# EAGLE design BT-5 (EAGLE 9.6.2)
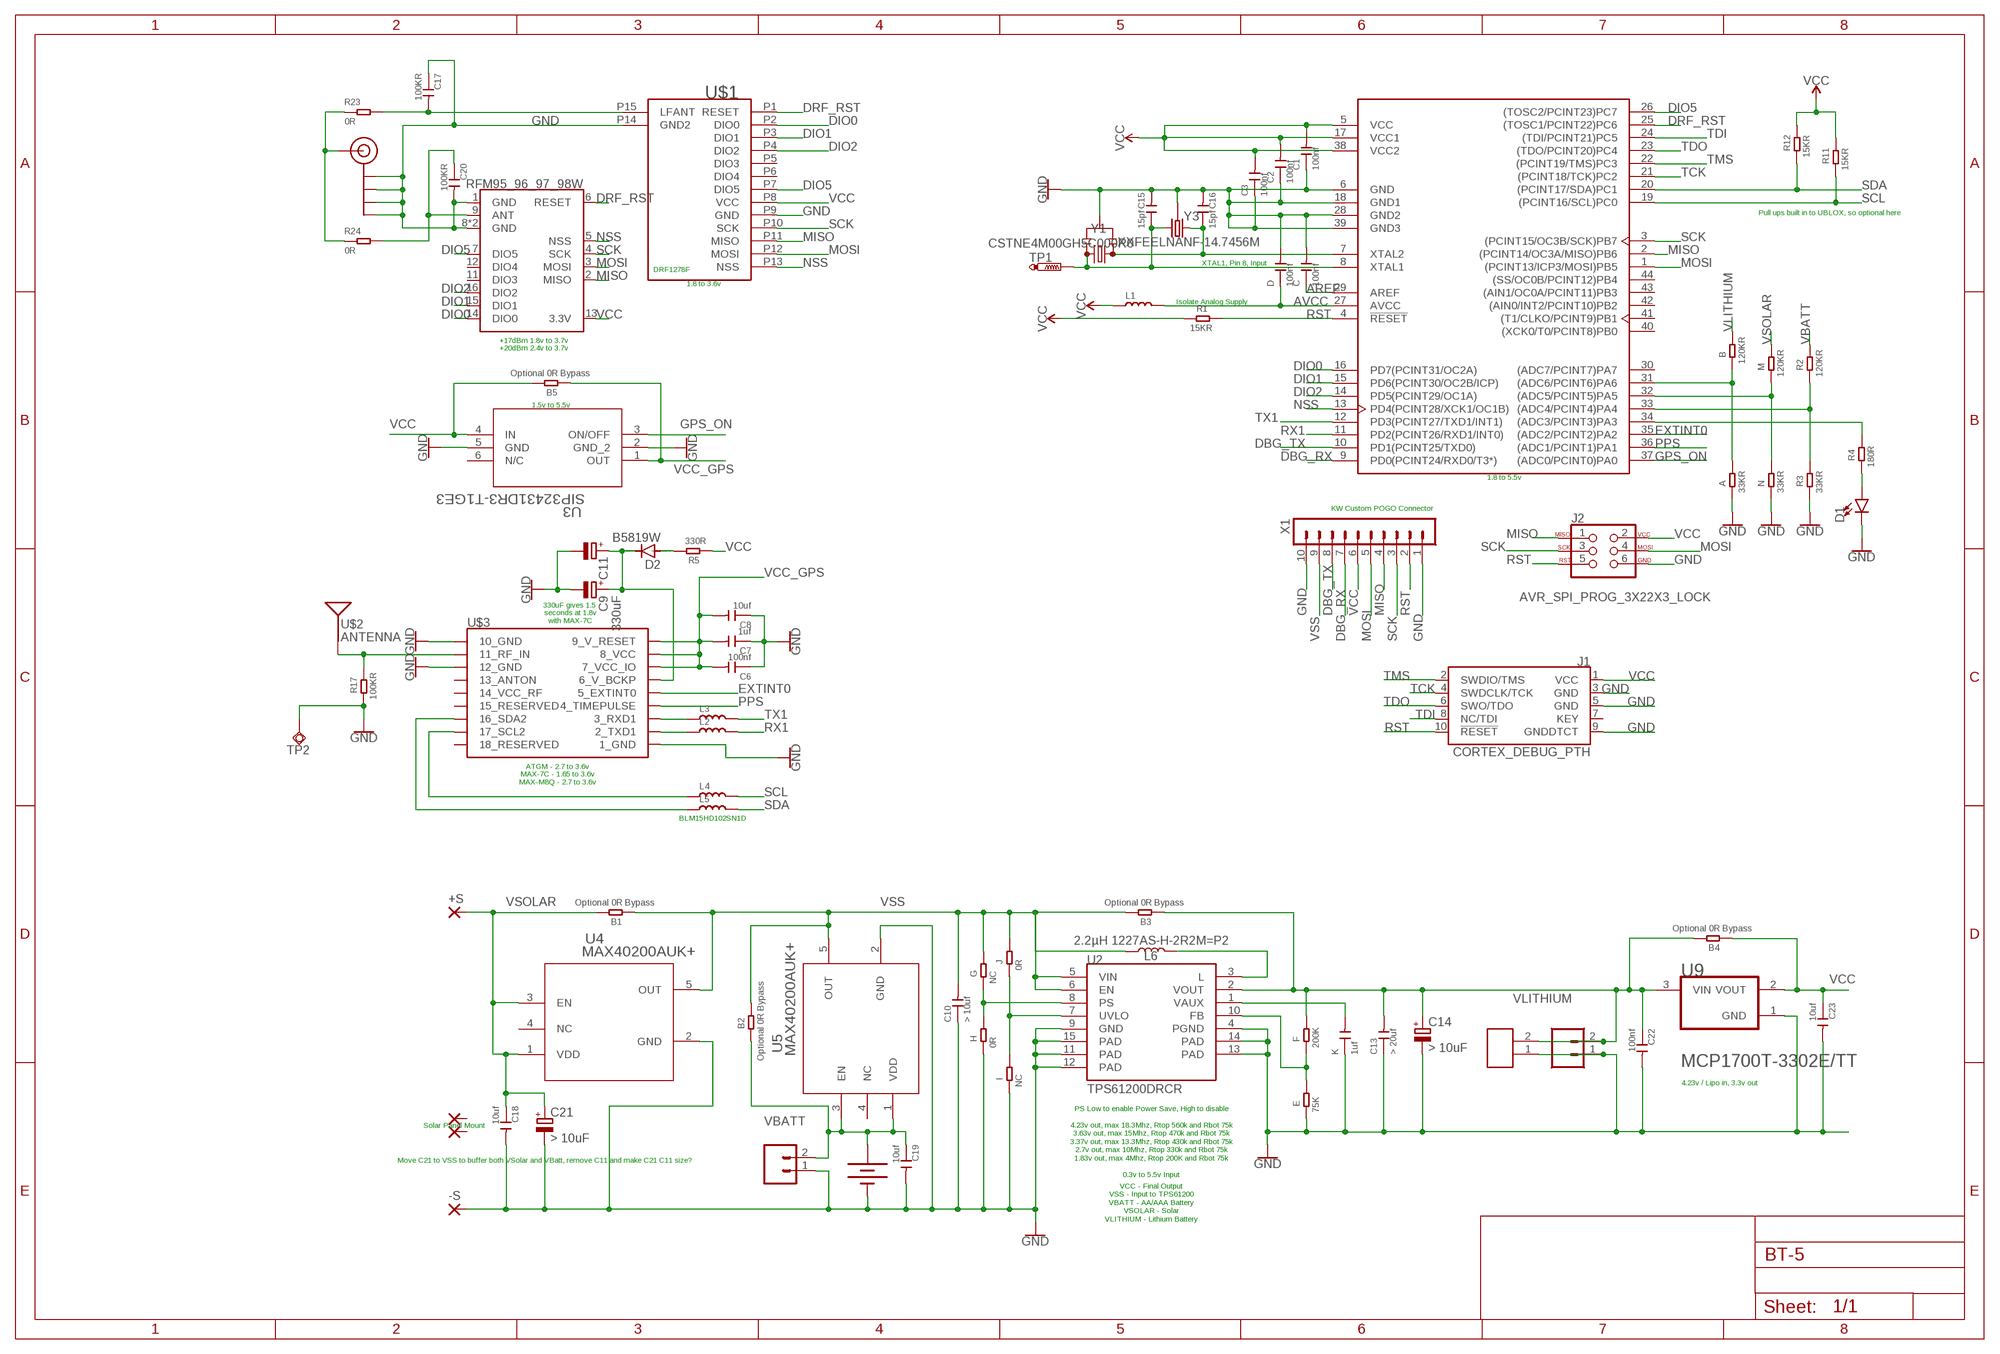
[diagram p0: schematic, sheet 1]

## Parts
+S  SMD2  [SMD1,27-2,54]
-S  SMD2  [SMD1,27-2,54]
A  33KR  SMD-RES-20K-5%-1/16W(0402)  [R0402]
B  120KR  SMD-RES-20K-5%-1/16W(0402)  [R0402]
B1  Optional 0R Bypass  SMD-RES-20K-5%-1/16W(0402)  [R0402]
B2  Optional 0R Bypass  SMD-RES-20K-5%-1/16W(0402)  [R0402]
B3  Optional 0R Bypass  SMD-RES-20K-5%-1/16W(0402)  [R0402]
B4  Optional 0R Bypass  SMD-RES-20K-5%-1/16W(0402)  [R0402]
B5  Optional 0R Bypass  SMD-RES-20K-5%-1/16W(0402)  [R0402]
BT1  BATTERY  [BATTERY-AA-AAA]
C  100nf  CERAMIC-100NF-25V-10%-X7R(0402)  [C0402]
C1  100nf  CERAMIC-100NF-25V-10%-X7R(0402)  [C0402]
C2  100nf  CERAMIC-100NF-25V-10%-X7R(0402)  [C0402]
C3  100nf  CERAMIC-100NF-25V-10%-X7R(0402)  [C0402]
C6  100nf  CERAMIC-100NF-25V-10%-X7R(0402)  [C0402]
C7  1uf  CERAMIC-1UF-10V-10%-X5R(0402)  [C0402]
C8  10uf  CERAMIC-10UF-6.3V-20%-X5R(0402)  [C0402]
C9  330uF  RCL_CPOL-EUSMCC  [RCL_SMC_C]
C10  > 10uf  CERAMIC-10UF-10V-10%-X5R(0603)  [C0603]
C11  C-POL_ECAP-10.5MM  [CAPAE1030X1050N]
C13  > 20uf  CERAMIC-10UF-10V-10%-X5R(0603)  [C0603]
C14  > 10uF  RCL_CPOL-EUSMCC  [RCL_SMC_C]
C15  15pf  CERAMIC-100NF-25V-10%-X7R(0402)  [C0402]
C16  15pf  CERAMIC-100NF-25V-10%-X7R(0402)  [C0402]
C17  100KR  CERAMIC-10UF-6.3V-20%-X5R(0402)  [C0402]
C18  10uf  CERAMIC-10UF-6.3V-20%-X5R(0402)  [C0402]
C19  10uf  CERAMIC-10UF-6.3V-20%-X5R(0402)  [C0402]
C20  100KR  CERAMIC-10UF-6.3V-20%-X5R(0402)  [C0402]
C21  > 10uF  RCL_CPOL-EUSMCC  [RCL_SMC_C]
C22  100nf  CERAMIC-100NF-25V-10%-X7R(0402)  [C0402]
C23  10uf  CERAMIC-10UF-6.3V-20%-X5R(0402)  [C0402]
D  100nf  CERAMIC-100NF-25V-10%-X7R(0402)  [C0402]
D1  LED0603  [LED-0603]
D2  B5819W  DIODE-SOD123  [SOD123]
E  75K  SMD-RES-20K-5%-1/16W(0402)  [R0402]
F  200K  SMD-RES-20K-5%-1/16W(0402)  [R0402]
G  NC  SMD-RES-20K-5%-1/16W(0402)  [R0402]
H  0R  SMD-RES-20K-5%-1/16W(0402)  [R0402]
I  NC  SMD-RES-20K-5%-1/16W(0402)  [R0402]
J  0R  SMD-RES-20K-5%-1/16W(0402)  [R0402]
J1  CORTEX_DEBUG_PTH  [2X5-PTH-1.27MM]
J2  AVR_SPI_PROG_3X22X3_LOCK  [2X3_LOCK]
J4  CONN_02JST-PTH-2-KIT  [JST-2-PTH-KIT]
J5  JST_ZH_2PIN  [JST_ZH_2PIN]
J6  CONN_02JST-PTH-2-KIT  [JST-2-PTH-KIT]
J$1  SMA_EDGE  [SMA-EDGE]
K  1uf  CERAMIC-1UF-10V-10%-X5R(0402)  [C0402]
L1  BLM15HD102SN1D  SMD-INDUCTOR-3.3NH-0.3NH-300MA(0402)  [L0402]
L2  BLM15HD102SN1D  SMD-INDUCTOR-3.3NH-0.3NH-300MA(0402)  [L0402]
L3  BLM15HD102SN1D  SMD-INDUCTOR-3.3NH-0.3NH-300MA(0402)  [L0402]
L4  BLM15HD102SN1D  SMD-INDUCTOR-3.3NH-0.3NH-300MA(0402)  [L0402]
L5  BLM15HD102SN1D  SMD-INDUCTOR-3.3NH-0.3NH-300MA(0402)  [L0402]
L6  2.2µH 1227AS-H-2R2M=P2  INDUCTOR-CDRH-4.7UH  [INDUCTOR_4.7UH]
M  120KR  SMD-RES-20K-5%-1/16W(0402)  [R0402]
N  33KR  SMD-RES-20K-5%-1/16W(0402)  [R0402]
NC1  SMD2  [SMD1,27-2,54]
NC2  SMD2  [SMD1,27-2,54]
R1  15KR  SMD-RES-20K-5%-1/16W(0402)  [R0402]
R2  120KR  SMD-RES-20K-5%-1/16W(0402)  [R0402]
R3  33KR  SMD-RES-20K-5%-1/16W(0402)  [R0402]
R4  180R  SMD-RES-20K-5%-1/16W(0402)  [R0402]
R5  330R  SMD-RES-20K-5%-1/16W(0402)  [R0402]
R11  15KR  SMD-RES-20K-5%-1/16W(0402)  [R0402]
R12  15KR  SMD-RES-20K-5%-1/16W(0402)  [R0402]
R17  100KR  SMD-RES-20K-5%-1/16W(0402)  [R0402]
R23  0R  SMD-RES-0R-1%-1/10W(0603)  [R0603]
R24  0R  SMD-RES-0R-1%-1/10W(0603)  [R0603]
TP1  TESTPAD_PTR1TP10R  [TESTPAD_TP10R]
TP2  TPSQTP08SQ  [TP08SQ]
U1  ATMEGA1284P-AU  [TQFP-44]
U2  TPS61200DRCR  TPS61200  [QFN-10_PAD]
U3  SIP32431DR3-T1GE3  [SC-70-6_VIS]
U4  MAX40200AUK+  RAJX_V4.5_REVA_MAX40200AUK+  [RAJX_V4.5_REVA_21-0057F_MXM]
U5  MAX40200AUK+  RAJX_V4.5_REVA_MAX40200AUK+  [RAJX_V4.5_REVA_21-0057F_MXM]
U6  RFM95_96_97_98W  RFM69HCW-433  [RFM69HCW-XXXS2]
U9  MICROCHIP_MCP1700T-3302E-TTMICROCHIP_MCP1700T-3302E-TT_0_0  [MICROCHIP_MCP1700T-3302E-TT_0]
U$1  DRF1278F  DRF1278F_2NO_PINS  [DRF1278F_2_NO_PINS]
U$2  ANTENNA  [ANT-GPS-3X10MM]
U$3  AVA_UBLOX_MAX-6  [AVA_UBLOX_MAX-6]
X1  KEW_HF_V13_M_1R10KW_50MIL-H  [KEW_HF_V13_M_1R09_50MIL-H]
Y1  CSTNE4M00GH5C000R0  SPARKFUN-CLOCKS-KW_RESONATOR-8MHZSMD_3.2X1.3  [SPARKFUN-CLOCKS-KW_RESONATOR-SMD-3.2X1.3]
Y3  XXFEELNANF-14.7456M  CRYSTAL-GROUNDEDSMD-3.2X2.5  [CRYSTAL-SMD-3.2X2.5MM]

## Nets
AREF: C.1 U1.29(AREF)
AVCC: D.1 L1.2 U1.27(AVCC)
DBG_RX: U1.9(PD0(PCINT24/RXD0/T3*)) X1.7
DBG_TX: U1.10(PD1(PCINT25/TXD0)) X1.8
DIO0: U1.16(PD7(PCINT31/OC2A)) U6.14(DIO0) U$1.P2(DIO0)
DIO1: U1.15(PD6(PCINT30/OC2B/ICP)) U6.15(DIO1) U$1.P3(DIO1)
DIO2: U1.14(PD5(PCINT29/OC1A)) U6.16(DIO2) U$1.P4(DIO2)
DIO5: U1.26((TOSC2/PCINT23)PC7) U6.7(DIO5) U$1.P7(DIO5)
DRF_RST: U1.25((TOSC1/PCINT22)PC6) U6.6(RESET) U$1.P1(RESET)
EXTINT0: U1.35((ADC2/PCINT2)PA2) U$3.5_EXTINT0
FB: E.2 F.1 U2.10(FB)
GND: -S.1(P) A.1 BT1.P$2(-) BT1.P$4(-) BT1.P$7(-) BT1.P$8(-) C1.1 C2.1 C3.1 C6.1 C7.1 C8.1 C9.- C10.1 C11.2(-) C13.1 C14.- C15.2 C16.2 C17.1 C18.2 C19.2 C20.2 C21.- C22.2 C23.2 C.2 D1.C D.2 E.1 H.1 I.1 J1.3(GND) J1.5(GND) J1.9(GNDDTCT) J2.6 J4.1 J5.1 J6.1 J$1.GND@0(GND) J$1.GND@1(GND) J$1.GND@2(GND) J$1.GND@3(GND) K.1 N.1 R3.1 R17.1 TP2.TP U1.6(GND) U1.18(GND1) U1.28(GND2) U1.39(GND3) U2.4(PGND) U2.9(GND) U2.11(PAD) U2.12(PAD) U2.13(PAD) U2.14(PAD) U2.15(PAD) U3.2(GND_2) U3.5(GND) U4.2(GND) U5.2(GND) U6.1(GND) U6.8(GND) U6.10(GND) U9.1(GND) U$1.P9(GND) U$1.P14(GND2) U$3.1_GND U$3.10_GND U$3.12_GND X1.1 X1.10 Y1.2 Y3.2 Y3.4
GPS_ON: U1.37((ADC0/PCINT0)PA0) U3.3(ON/OFF)
L: L6.P$2 U2.3(L)
MISO: J2.1 U1.2((PCINT14/OC3A/MISO)PB6) U6.2(MISO) U$1.P11(MISO) X1.4
MOSI: J2.4 U1.1((PCINT13/ICP3/MOSI)PB5) U6.3(MOSI) U$1.P12(MOSI) X1.5
N$1: C17.2 R23.2 U$1.P15(LFANT)
N$2: D1.A R4.1
N$3: C15.1 TP1.TP U1.8(XTAL1) Y1.3 Y3.3
N$4: C16.1 U1.7(XTAL2) Y1.1 Y3.1
N$5: R2.1 R3.2 U1.33((ADC4/PCINT4)PA4)
N$7: M.1 N.2 U1.32((ADC5/PCINT5)PA5)
N$8: R4.2 U1.34((ADC3/PCINT3)PA3)
N$10: R17.2 U$2.SIG(SIGNAL) U$3.11_RF_IN
N$11: C9.+ C11.1(+) D2.C U$3.6_V_BCKP
N$12: L3.1 U$3.3_RXD1
N$13: L2.1 U$3.2_TXD1
N$14: L4.1 U$3.17_SCL2
N$15: L5.1 U$3.16_SDA2
N$16: D2.A R5.2
N$20: A.2 B.1 U1.31((ADC6/PCINT6)PA6)
N$23: C20.1 R24.2 U6.9(ANT)
N$24: J$1.SIG(SIGNAL) R23.1 R24.1
NSS: U1.13(PD4(PCINT28/XCK1/OC1B)) U6.5(NSS) U$1.P13(NSS)
PPS: U1.36((ADC1/PCINT1)PA1) U$3.4_TIMEPULSE
PS: G.1 H.2 U2.8(PS)
RST: J1.10(!RESET) J2.5 R1.2 U1.4(!RESET) X1.2
RX1: L2.2 U1.11(PD2(PCINT26/RXD1/INT0))
SCK: J2.3 U1.3((PCINT15/OC3B/SCK)PB7) U6.4(SCK) U$1.P10(SCK) X1.3
SCL: L4.2 R11.1 U1.19((PCINT16/SCL)PC0)
SDA: L5.2 R12.1 U1.20((PCINT17/SDA)PC1)
TCK: J1.4(SWDCLK/TCK) U1.21((PCINT18/TCK)PC2)
TDI: J1.8(NC/TDI) U1.24((TDI/PCINT21)PC5)
TDO: J1.6(SWO/TDO) U1.23((TDO/PCINT20)PC4)
TMS: J1.2(SWDIO/TMS) U1.22((PCINT19/TMS)PC3)
TX1: L3.2 U1.12(PD3(PCINT27/TXD1/INT1))
UVLO: I.2 J.1 U2.7(UVLO)
VAUX: K.2 U2.1(VAUX)
VBATT: B2.1 BT1.P$1(+) BT1.P$3(+) BT1.P$5(+) BT1.P$6(+) C19.1 J4.2 R2.2 U5.1(VDD) U5.3(EN)
VCC: B4.1 B5.2 C1.2 C2.2 C3.2 C23.1 J1.1(VCC) J2.2 L1.1 R1.1 R5.1 R11.2 R12.2 U1.5(VCC) U1.17(VCC1) U1.38(VCC2) U3.4(IN) U6.13(3.3V) U9.2(VOUT) U$1.P8(VCC) X1.6
VCC_GPS: B5.1 C6.2 C7.2 C8.2 U3.1(OUT) U$3.7_VCC_IO U$3.8_VCC U$3.9_V_RESET
VLITHIUM: B3.1 B4.2 B.2 C13.2 C14.+ C22.1 F.2 J5.2 J6.2 U2.2(VOUT) U9.3(VIN)
VSOLAR: +S.1(P) B1.2 C18.1 C21.+ M.2 U4.1(VDD) U4.3(EN)
VSS: B1.1 B2.2 B3.2 C10.2 G.2 J.2 L6.P$1 U2.5(VIN) U2.6(EN) U4.5(OUT) U5.5(OUT) X1.9
Unconnected: J1.7(KEY) NC1.1(P) NC2.1(P) U1.30((ADC7/PCINT7)PA7) U1.40((XCK0/T0/PCINT8)PB0) U1.41((T1/CLKO/PCINT9)PB1) U1.42((AIN0/INT2/PCINT10)PB2) U1.43((AIN1/OC0A/PCINT11)PB3) U1.44((SS/OC0B/PCINT12)PB4) U3.6(N/C) U4.4(NC) U5.4(NC) U6.11(DIO3) U6.12(DIO4) U$1.P5(DIO3) U$1.P6(DIO4) U$3.13_ANTON U$3.14_VCC_RF U$3.15_RESERVED U$3.18_RESERVED

## Notes on the sheet
- Pull ups built in to UBLOX, so optional here
- XTAL1, Pin 8, Input
- DRF1278F
- 1.8 to 3.6v
- Isolate Analog Supply
- +17dBm 1.8v to 3.7v
  +20dBm 2.4v to 3.7v
- 1.5v to 5.5v
- 1.8 to 5.5v
- KW Custom POGO Connector
- 330uF gives 1.5 
  seconds at 1.8v
  with MAX-7C
- ATGM - 2.7 to 3.6v
  MAX-7C - 1.65 to 3.6v
  MAX-M8Q - 2.7 to 3.6v
- BLM15HD102SN1D
- 4.23v / Lipo in, 3.3v out
- PS Low to enable Power Save, High to disable
  
  4.23v out, max 18.3Mhz, Rtop 560k and Rbot 75k
  3.63v out, max 15Mhz, Rtop 470k and Rbot 75k
  3.37v out, max 13.3Mhz, Rtop 430k and Rbot 75k
  2.7v out, max 10Mhz, Rtop 330k and Rbot 75k
  1.83v out, max 4Mhz, Rtop 200K and Rbot 75k
  
  0.3v to 5.5v Input
- Solar Panel Mount
- Move C21 to VSS to buffer both VSolar and VBatt, remove C11 and make C21 C11 size?
- VCC - Final Output
  VSS - Input to TPS61200
  VBATT - AA/AAA Battery
  VSOLAR - Solar
  VLITHIUM - Lithium Battery

## Library data of the parts
+S -S NC1 NC2 = wirepad:SMD2: SMD PAD
A B B1-B5 E F G I M N R1-R5 R11 R12 R17 = OPL_Resistor:SMD-RES-20K-5%-1/16W(0402): 301012018; MPN: RC0402JR-070RL; VALUE: 0R
BT1 = Dual AA and AAA - RS Keystone 55 and 53 SMD:BATTERY: Battery - Single Cell A variety of battery chemistries, sizes, and footprints. Device List: 20MM_PTH - Coin Cell Battery Holder - 20mm (PTH) <https://www.sparkfun.com/products/783> 6.8MM_PTH - Coin Cell Battery Holder - 6.8MM(SMD) <https://www.digikey.com/product-detail/en/seiko-instruments/MS621FE-FL11E/728-1057-ND/1889208?WT.srch=1&gclid=CNOQ5a6LzdQCFZS2wAodXCkE0g> 12MM_SMD - Coin Cell Battery Holder - 12mm (SMD) <https://www.sparkfun.com/products/10592> 12MM_PTH - Coin Cell Battery Holder - 12mm (PTH) <https://www.sparkfun.com/products/7948> 20MM_SMD - 20mm Coin Cell Battery Holder (SMD) (2 legs) Used on the Big Time Watch Kit <https://www.sparkfun.com/products/11734> 20MM_SMD_4LEGS - Coin Cell Battery Holder - 20mm (SMD) <https://www.sparkfun.com/products/11892> 20MM_SMD_4LEGS_OVERPASTE - Coin Cell Battery Holder - 20mm (SMD) <https://www.sparkfun.com/products/11892> (Over-paste on the legs) 24.5MM_PTH - Coin Cell Battery Holder - 24.5mm (PTH) <https://www.sparkfun.com/products/8863> 9V - 9V Battery Holder - PC Mount Used on the SparkFun SparkPunk Sound Kit <https://www.sparkfun.com/products/11177> and SparkFun SparkPunk Sequencer Kit <https://www.sparkfun.com/products/12707> 18650 - Battery Holder - 18650 (PTH) <https://www.sparkfun.com/products/13113> AA - Battery Holder - 1xAA (PTH) <https://www.sparkfun.com/products/7949> AAA - Battery Holder - 1xAAA (PTH) <https://www.sparkfun.com/products/12718> AA_KIT - Battery Holder - 1xAA (PTH) <https://www.sparkfun.com/products/7949> Special kit package - pads only have exposed copper on one side of the board. AAA_KIT - Battery Holder - 1xAAA (PTH) <https://www.sparkfun.com/products/12718> Special kit package - pads only have exposed copper on one side of the board.
C C1-C3 C6 C22 D = OPL_Capacitor:CERAMIC-100NF-25V-10%-X7R(0402): 302010024; MPN: CC0402KRX7R8BB104
C7 K = OPL_Capacitor:CERAMIC-1UF-10V-10%-X5R(0402): 302010040; MPN: CC0402KRX5R6BB105
C8 C18 C19 C23 = OPL_Capacitor:CERAMIC-10UF-6.3V-20%-X5R(0402): 302010053; MPN: CC0402MRX5R5BB106
C9 C14 C21 = KEW_HF_V16:RCL_CPOL-EU: POLARIZED CAPACITOR, European symbol
C10 C13 = OPL_Capacitor:CERAMIC-10UF-10V-10%-X5R(0603): 302010103; MPN: CC0603KRX5R6BB106; VALUE: 10uf
C11 = Capacitor:C-POL: Capacitor Polarised - Generic; CATEGORY: Capacitor
C15 C16 = OPL_Capacitor:CERAMIC-100NF-25V-10%-X7R(0402): 302010024; MPN: CC0402KRX7R8BB104; VALUE: 100nf
C17 C20 = OPL_Capacitor:CERAMIC-10UF-6.3V-20%-X5R(0402): 302010053; MPN: CC0402MRX5R5BB106; VALUE: 10uf
D1 = SparkFun-LED:LED: LED (Generic) Standard schematic elements and footprints for 5mm, 3mm, 1206, and 0603 sized LEDs. Generic LEDs with no color specified.
D2 = diode:DIODE-: DIODE; LCSC_PART: C8598
H J = OPL_Resistor:SMD-RES-20K-5%-1/16W(0402): 301012018; MPN: RC0402JR-070RL
J1 = SparkFun-Connectors:CORTEX_DEBUG: Cortex Debug Connector - 10 pin Supports JTAG debug, Serial Wire debug, and Serial Wire Viewer. PTH and SMD connector options available. General Connector Information <http://infocenter.arm.com/help/topic/com.arm.doc.faqs/attached/13634/cortex_debug_connectors.pdf> Products: PTH Connector <http://www.digikey.com/product-detail/en/cnc-tech/3220-10-0100-00/1175-1627-ND/3883661> -via Digi-Key SparkFun PSoc <https://www.sparkfun.com/products/13229> SparkFun T <https://www.sparkfun.com/products/13810>
J2 = SparkFun-Connectors:AVR_SPI_PROG_3X2: AVR ISP 6 Pin This is the reduced ISP connector for AVR programming. Common on Arduino. This footprint will take up less PCB space and can be used with a 10-pin to 6-pin adapter such as SKU: BOB-08508 **Special note about "TEST_POINT" package. The stop mask is on the top side, so if you want your programming test points to be on the bottom of your board, make sure to place this package on the bottom side of the board. This also ensure that the orientation to program from the bottom side will be correct. SparkFun Products: SparkFun ISP Pogo Adapter <https://www.sparkfun.com/products/11591> - NS Tiny AVR Programmer <https://www.sparkfun.com/products/11801> -PTH
J4 J6 = ESP32-Cam-Pico-V4:CONN_02: Multi connection point. Often used as Generic Header-pin footprint for 0.1 inch spaced/style header connections On any of the 0.1 inch spaced packages, you can populate with these: Break Away Headers - Straight <https://www.sparkfun.com/products/116> (PRT-00116) Break Away Male Headers - Right Angle <https://www.sparkfun.com/products/553> (PRT-00553) Female Headers <https://www.sparkfun.com/products/115> (PRT-00115) Break Away Headers - Machine Pin <https://www.sparkfun.com/products/117> (PRT-00117) Break Away Female Headers - Swiss Machine Pin <https://www.sparkfun.com/products/743> (PRT-00743) For SCREWTERMINALS and SPRING TERMINALS visit here: Screw Terimnals on SparkFun.com <https://www.sparkfun.com/search/results?term=Screw+Terminals> (5mm/3.5mm/2.54mm spacing) This device is also useful as a general connection point to wire up your design to another part of your project. Our various solder wires solder well into these plated through hole pads. Hook-Up Wire - Assortment (Stranded, 22 AWG) <https://www.sparkfun.com/products/11375> (PRT-11375) Hook-Up Wire - Assortment (Solid Core, 22 AWG) <https://www.sparkfun.com/products/11367> (PRT-11367) View the entire wire category on our website here <https://www.sparkfun.com/categories/141> Special notes: Molex polarized connector foot print use with: PRT-08233 with associated crimp pins and housings. 2.54_SCREWTERM for use with PRT-10571. 3.5mm Screw Terminal footprints for PRT-08084 5mm Screw Terminal footprints for use with PRT-08432; PROD_ID: CONN-13512; SF_ID: PRT-09918; SF_SKU: PRT-08432; SKU: PRT-09914; STOREFRONT_SKU: PRT-15898
J5 = ESP32-Cam-Pico-V4:JST_ZH_2PIN: JST ZH connector, 2 pins ZH has 1.5mm spacing. Datasheet <http://www.jst-mfg.com/product/pdf/eng/eZH.pdf>
J$1 = ESP32-Cam-Pico-V4:SMA_EDGE: SMA Antenna Connector End launch SMA connector. The paste layer has been removed so that the connector can be hand soldered onto the board after reflow.
L1-L5 = OPL_Inductor:SMD-INDUCTOR-3.3NH-0.3NH-300MA(0402): 303010056; VALUE: 3.3NH- 300MA
L6 = SparkFun-Coils:INDUCTOR: Inductors Resist changes in electrical current. Basically a coil of wire. SparkFun Products: SparkFun Load Cell Amplifier - HX711 <https://www.sparkfun.com/products/13879> IOIO-OTG - V2.2 <https://www.sparkfun.com/products/13613>; LCSC_PART: C435389; PROD_ID: NDUC-10146; VALUE: 4.7µH/±30%/1.2A
R23 R24 = OPL_Resistor:SMD-RES-0R-1%-1/10W(0603): 301012029; MPN: RC0603FR-071K5L; VALUE: 1.5K
TP1 = KEW_HF_V16:TESTPAD_PTR1: TEST PIN
TP2 = testpad:TPSQ: Test pad
U1 = Microcontroller:ATMEGA1284P-AU: IC MCU 8BIT 128KB FLASH 44TQFP Manufacturer's datasheet <http://ww1.microchip.com/downloads/en/DeviceDoc/ATmega164A_PA-324A_PA-644A_PA-1284_P_Data-Sheet-40002070A.pdf>; CREATED_BY: PCBLayout.com; DIGIKEY_PART_NUMBER: ATMEGA1284P-AU-ND; LCSC_PART: C33575; MANUFACTURER: Microchip Technology; MPN: ATMEGA1284P-AU; PACKAGE: TQFP-44
U2 = SparkFun-IC-Power:TPS61200: DC to DC Booster IC-10035; LCSC_PART: C140320; PROD_ID: IC-10035
U3 = SIP32431DR3T1GE3:SIP32431DR3-T1GE3; BUILT_BY: EMA_Anthony; COPYRIGHT: Copyright (C) 2018 Accelerated Designs. All rights reserved; DATASHEET: VY1332M51Y5UC63V0; LCSC_PART: C141606; MANUFACTURER_PART_NUMBER: SIP32431DR3-T1GE3; SOURCELIBRARY: Vishay_2019-11-13; VENDOR: Vishay
U4 U5 = KEW_HF_V16:RAJX_V4.5_REVA_MAX40200AUK+; BUILT_BY: EMA_UL_Team; COPYRIGHT: Copyright (C) 2018 Accelerated Designs. All rights reserved; MANUFACTURER_PART_NUMBER: MAX40200AUK+; SOURCELIBRARY: Maxim_2018-11-30; VENDOR: Maxim Integrated Products
U6 = SparkFun-RF:RFM69H: Hope RF RFM69H ISM Transceiver Module The RFM69H is a transceiver module capable of operation over a wide frequency range, including the 315,433,868 and 915MHz license-free ISM (Industry Scientific and Medical) frequency bands. All major RF communication parameters are programmable and most of them can be dynamically set. The RFM69H offers the unique advantage of programmable narrow-band and wide- band communication modes. The RFM69H is optimized for low power consumption while offering high RF output power and channelized operation.Compliance ETSI and FCC regulations. Datasheet <http://www.hoperf.cn/upload/docs/RF/SX/RFM69H_DataSheet_v1.3.pdf> SparkFun Products RFM69HCW Wireless Transceiver - 915MHz <https://www.sparkfun.com/products/13909> (COM-13909) RFM69HCW Wireless Transceiver - 434MHz <https://www.sparkfun.com/products/13910> (COM-13910) SparkFun RFM69 Breakout (915MHz) <https://www.sparkfun.com/products/12775> (WRL-12775) SparkFun RFM69 Breakout (434MHz) <https://www.sparkfun.com/products/12823> (WRL-12823); PROD_ID: IC-12053; VALUE: 433MHz
U9 = TT:MICROCHIP_MCP1700T-3302E-TT: PM-LINEREG-MCP1700-IL3; CIIVA_IDS: 1493168; CODE__IPC: SOT23-3; DATASHEET_VERSION: revB, Feb-2007; FOOTPRINT_VARIANT_NAME_0: Level C; FOOTPRINT_VARIANT_NAME_1: Level B; FOOTPRINT_VARIANT_NAME_2: Level A; IMPORTED: yes; IMPORTED_FROM: vault; IMPORT_TS: 1521863263; MF: Microchip; MPN: MCP1700T-3302E/TT; PACKAGE: SOT-23-TT3; PACKAGE_DESCRIPTION: 3-Lead Plastic Small Outline Transistor (TT) [SOT-23]; PACKAGE_VERSION: revBB, Aug-2009; PREFIX: U; RELEASE_DATE: 1300337874; VAULT_GUID: FC249BAA-482B-455F-891A-041333026DEA; VAULT_REVISION: 0277CE2B-AC06-49C2-8AC0-2EBE9F51AB5A
U$1 = DRF1278F:DRF1278F_2
U$2 = GPS Antenna RainSun GPS1003-1575:ANTENNA: Single-ended Antennae 1.575GHz antennae with just one terminal. These are all chip antennae. 1575MHz (GPS) Antennae ANT-GPS-2X7MM - 2.0 x 7.0 mm chip antenna. (SparkFun Product <https://www.sparkfun.com/products/9131>) ANT-GPS-2X8MM - 2.0 x 8.0 mm chip antenna. (SparkFun Product <https://www.sparkfun.com/products/8418>)
U$3 = KEW_HF_V16:AVA_UBLOX_MAX-6: UBLOX MAX-6
X1 = KEW_HF_V16:KEW_HF_V13_M_1R10KW: Pin header, male, 1 row
Y1 = KEW_HF_V16:SPARKFUN-CLOCKS-KW_RESONATOR-8MHZ: 8MHz Resonator Digikey Example <http://www.digikey.com/product-detail/en/murata-electronics-north-america/CSTCE10M0G55-R0/490-1196-1-ND/584633> Frequency: 8MHz Frequency Stability: ±0.2% Frequency Tolerance: ±0.5% Capacitance: 33pF SparkFun Products Arduino Pro Mini 328- 3.3V/8MHz <https://www.sparkfun.com/products/11114> SparkFun Digital Sandbox <https://www.sparkfun.com/products/12651>; PROD_ID: XTAL-08895; VALUE: 8MHz
Y3 = SparkFun-Clocks:CRYSTAL-GROUNDED: Crystals w/ Ground Pin (Generic) These are passive quartz crystals, which can be used as a clock source for a microcontroller. Crystal's are usually two-terminal devices. A third terminal may be optionally connected to ground, as recommended by the manufaturer.; LCSC_PART: C124311

## Board
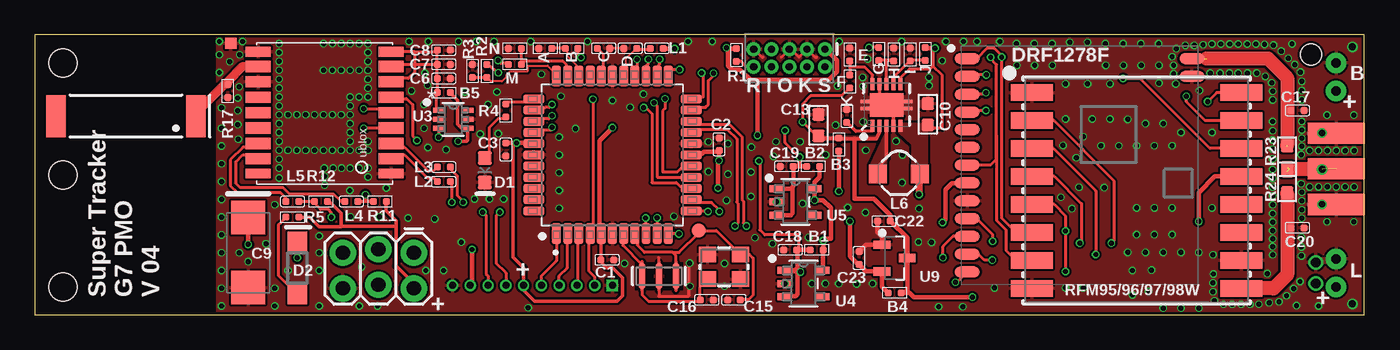
[diagram p1: board, top side]
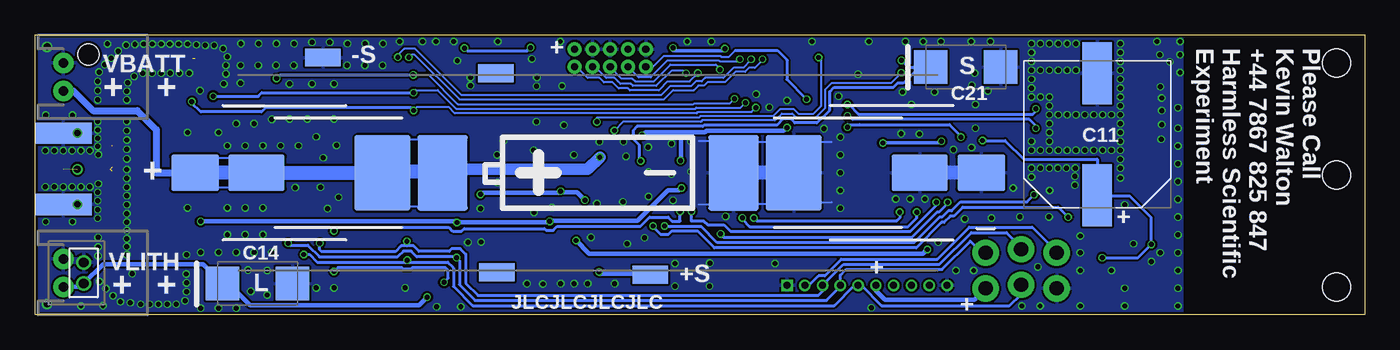
[diagram p2: board, bottom side, seen from below]

Size 95 x 20 mm. Coordinates in mm from the lower left corner, seen from the top.
Outline: 0,0 95,0 95,20 0,20 0,0
Copper layers (1*16): Top 0.035559375mm / dielectric 1.6mm / Bottom 0.035559375mm
Design rules "JLCpcb-2-layer-KW-Master": minimum track width 6mil, minimum drill 0.3mm, track to track 6mil, track to pad 6mil, pad to pad 6mil, via to via 10mil, smd to smd 6mil, copper to edge 8mil, drill to drill 6mil, minimum pad ring 5mil, minimum via ring 3mil, stop-mask expansion 2.5mil, vias tented up to drill 25mil, thermal gap 6mil
Holes 2 mm at 2,10 2,2 2,18
Holes 1.5 mm at 91.21,18.61

### Footprints (pad centres in the part's own frame; a part is rotated, then mirrored left to right if it is on the bottom)
SMD1,27-2,54 = smd 1.27 x 2.54: 1 0,0
R0402 = smd 0.5 x 0.5: 1 0,0.463; 2 0,-0.463
BATTERY-AA-AAA = smd 4 x 2.6: P$1 -23.7,0; P$2 23.7,0 | smd 3.6 x 5.4: P$3 -10.4,0; P$4 10.4,0 | smd 3.4 x 2.6: P$5 -28.1,0; P$8 28.1,0 | smd 4 x 5.4: P$6 -14.7,0; P$7 14.7,0
C0402 = smd 0.5 x 0.5: 1 0,0.463; 2 0,-0.463
RCL_SMC_C = smd 2.4 x 2.4: + -2.5,0; - 2.5,0
C0603 = smd 0.889 x 0.889: 1 0,0.762; 2 0,-0.762
CAPAE1030X1050N = smd 4.416 x 2.115: 1 -4.353,0; 2 4.353,0
LED-0603 = smd 1 x 1: A -0.877,0; C 0.877,0
SOD123 = smd 1.4 x 1.4: A 1.9,0; C -1.9,0
2X5-PTH-1.27MM = drill 0.508 pad 1: 1 -2.54,-0.635; 2 -2.54,0.635; 3 -1.27,-0.635; 4 -1.27,0.635; 5 0,-0.635; 6 0,0.635; 7 1.27,-0.635; 8 1.27,0.635; 9 2.54,-0.635; 10 2.54,0.635
2X3_LOCK = drill 1.016 pad 1.88: 1 0,0.127; 2 0,2.667; 3 2.54,-0.127; 4 2.54,2.413; 5 5.08,0.127; 6 5.08,2.667
JST-2-PTH-KIT = drill 0.7 pad 1.448: 1 -1,0; 2 1,0
JST_ZH_2PIN = drill 0.7 pad 1: 1 -0.75,0.45; 2 0.75,0.45
SMA-EDGE = smd 1.524 x 4.064: GND@0 0,0; GND@1 5.08,0; SIG 2.54,0 | smd 1.524 x 4.064 bottom: GND@2 0,0; GND@3 5.08,0
L0402 = smd 0.5 x 0.5: 1 -0.463,0; 2 0.463,0
INDUCTOR_4.7UH = smd 1.3 x 1.3: P$1 -1.5,0; P$2 1.5,0
R0603 = smd 0.889 x 0.889: 1 0,0.762; 2 0,-0.762
TESTPAD_TP10R = smd 1 x 1: TP 0,0
TP08SQ = smd 0.8 x 0.8: TP 0,0
TQFP-44 = smd 1.5 x 0.64: 1 -5.63,4; 2 -5.63,3.2; 3 -5.63,2.4; 4 -5.63,1.6; 5 -5.63,0.8; 6 -5.63,0; 7 -5.63,-0.8; 8 -5.63,-1.6; 9 -5.63,-2.4; 10 -5.63,-3.2; 11 -5.63,-4; 23 5.63,-4; 24 5.63,-3.2; 25 5.63,-2.4; 26 5.63,-1.6; 27 5.63,-0.8; 28 5.63,0; 29 5.63,0.8; 30 5.63,1.6; 31 5.63,2.4; 32 5.63,3.2; 33 5.63,4 | smd 0.64 x 1.5: 12 -4,-5.63; 13 -3.2,-5.63; 14 -2.4,-5.63; 15 -1.6,-5.63; 16 -0.8,-5.63; 17 0,-5.63; 18 0.8,-5.63; 19 1.6,-5.63; 20 2.4,-5.63; 21 3.2,-5.63; 22 4,-5.63; 34 4,5.63; 35 3.2,5.63; 36 2.4,5.63; 37 1.6,5.63; 38 0.8,5.63; 39 0,5.63; 40 -0.8,5.63; 41 -1.6,5.63; 42 -2.4,5.63; 43 -3.2,5.63; 44 -4,5.63
QFN-10_PAD = smd 0.297 x 0.85: 1 -1,-1.475; 2 -0.5,-1.475; 3 0,-1.475; 4 0.5,-1.475; 5 1,-1.475; 6 1,1.475; 7 0.5,1.475; 8 0,1.475; 9 -0.5,1.475; 10 -1,1.475 | smd 0.7 x 0.28: 11 -1.5,0.25; 12 -1.5,-0.25; 13 1.5,0.25; 14 1.5,-0.25 | smd 2.4 x 1.65: 15 0,0
SC-70-6_VIS = smd 0.813 x 0.356: 1 -1.041,0.65; 2 -1.041,0; 3 -1.041,-0.65; 4 1.041,-0.65; 5 1.041,0; 6 1.041,0.65
RAJX_V4.5_REVA_21-0057F_MXM = smd 0.978 x 0.508: 1 -1.365,0.95; 2 -1.365,0; 3 -1.365,-0.95; 4 1.365,-0.95; 5 1.365,0.95
RFM69HCW-XXXS2 = smd 3 x 1.2: 1 -7.5,7; 2 -7.5,5; 3 -7.5,3; 4 -7.5,1; 5 -7.5,-1; 6 -7.5,-3; 7 -7.5,-5; 8 -7.5,-7; 9 7.5,-7; 10 7.5,-5; 11 7.5,-3; 12 7.5,-1; 13 7.5,1; 14 7.5,3; 15 7.5,5; 16 7.5,7
MICROCHIP_MCP1700T-3302E-TT_0 = smd 1.2 x 0.6: 1 -0.9,0.95; 2 -0.9,-0.95; 3 0.9,0
DRF1278F_2_NO_PINS = smd 0.8 x 1.8: P1 16.12,16.53; P2 14.85,16.53; P3 13.57,16.53; P4 12.3,16.53; P5 11.04,16.53; P6 9.78,16.53; P7 8.5,16.53; P8 7.23,16.53; P9 5.96,16.53; P10 4.69,16.53; P11 3.42,16.53; P12 2.15,16.53; P13 0.88,16.53; P14 14.85,0.48; P15 16.12,0.48
ANT-GPS-3X10MM = smd 1.4 x 3: NC 5,0; SIG -5,0
AVA_UBLOX_MAX-6 = smd 1.8 x 0.7: 1_GND 4.95,-4.4; 9_V_RESET 4.95,4.3; 10_GND -4.55,4.3; 18_RESERVED -4.55,-4.4 | smd 1.8 x 0.8: 2_TXD1 4.95,-3.35; 3_RXD1 4.95,-2.25; 4_TIMEPULSE 4.95,-1.15; 5_EXTINT0 4.95,-0.05; 6_V_BCKP 4.95,1.05; 7_VCC_IO 4.95,2.15; 8_VCC 4.95,3.25; 11_RF_IN -4.55,3.25; 12_GND -4.55,2.15; 13_ANTON -4.55,1.05; 14_VCC_RF -4.55,-0.05; 15_RESERVED -4.55,-1.15; 16_SDA2 -4.55,-2.25; 17_SCL2 -4.55,-3.35
KEW_HF_V13_M_1R09_50MIL-H = drill 0.5 pad 0.813 square: 1 -5.08,0 | drill 0.5 pad 0.813: 2 -3.81,0; 3 -2.54,0; 4 -1.27,0; 5 0,0; 6 1.27,0; 7 2.54,0; 8 3.81,0; 9 5.08,0; 10 6.35,0
SPARKFUN-CLOCKS-KW_RESONATOR-SMD-3.2X1.3 = smd 0.45 x 1.905: 1 -1.2,0; 2 0,0; 3 1.2,0
CRYSTAL-SMD-3.2X2.5MM = smd 1.2 x 1.1: 1 -1.175,-0.875; 2 1.175,-0.875; 3 1.175,0.875; 4 -1.175,0.875

### Placement (x,y rotation side)
+S  51.07,2.86 270 bottom
-S  74.45,18.39 270 bottom
A  36.47,19.05 90 top
B  38.35,19.05 90 top
B1  55.88,4.65 270 top
B2  55.63,10.61 90 top
B3  57.46,12.17 0 top
B4  61.44,1.57 90 top
B5  29.21,15.88 90 top
BT1  55.5,10.15 0 bottom
C  40.64,19.05 90 top
C1  40.89,3.94 270 top
C2  48.9,12.19 0 top
C3  33.66,11.81 180 top
C6  29.21,16.89 270 top
C7  29.21,17.91 270 top
C8  29.21,18.92 270 top
C9  15.24,4.45 270 top
C10  63.82,14.34 0 top
C11  19.1,12.9 90 bottom
C13  56,13.55 0 top
C14  79.12,2.24 0 bottom
C15  49.96,1.07 270 top
C16  48.01,1.07 90 top
C17  10uf  [C0402]  90.23,14.61 270 top
C18  53.98,4.65 270 top
C19  53.72,10.61 270 top
C20  10uf  [C0402]  90.23,6.22 90 top
C21  28.5,17.7 0 bottom
C22  60.68,6.71 270 top
C23  58.9,4.06 180 top
D  42.55,19.05 270 top
D1  32.16,10.34 270 top
D2  18.77,3.35 270 top
E  58.24,18.6 0 top
F  58.24,16.69 0 top
G  60.31,18.65 180 top
H  61.39,18.61 0 top
I  62.56,18.59 0 top
J  63.63,18.64 180 top
J1  53.91,18.35 180 top
J2  27.08,4.56 180 top
J4  93,17 270 bottom
J5  92,3 270 bottom
J6  93,3 270 bottom
J$1  93,7.9 90 top
K  58.04,14.21 0 top
L1  44.45,19.05 180 top
L2  29.21,9.53 0 top
L3  29.21,10.57 0 top
L4  22.61,8.1 0 top
L5  18.41,8.1 0 top
L6  61.75,10.07 180 top
M  34.29,17.91 270 top
N  34.29,19.05 90 top
NC1  62.08,17.27 270 bottom
NC2  62.03,3.05 270 bottom
R1  50.14,18.57 0 top
R2  32.31,17.42 180 top
R3  31.27,17.42 0 top
R4  33.66,14.61 180 top
R5  18.41,6.99 270 top
R11  24.64,8.1 90 top
R12  20.45,8.1 90 top
R17  13.77,16 180 top
R23  89.5,11.3 180 top
R24  89.5,9.5 0 top
TP1  47.45,6.02 0 top
TP2  14,19.41 0 top
U1  41.27,11.43 90 top
U2  60.86,15 0 top
U3  29.9,13.97 0 top
U4  54.94,2.24 0 top
U5  54.36,8.08 0 top
U6  78.74,8.89 0 top
U9  61.44,4.06 0 top
U$1  83.17,2.2 90 top
U$2  6.5,14.2 180 top
U$3  20.5,14.5 0 top
X1  36.2,2.11 180 top
Y1  44.6,2.77 0 top
Y3  49.25,3.43 0 top

### Tracks (layer width: path | path; a pad name or v marks a point on that pad's centre or on a via)
AREF
  Top 0.203: C.1 40.21,19.05 40.62,18.65 40.62,17.2 U1.29
AVCC
  Top 0.152: D.1 42.91,18.95 42.88,18.95 42.22,18.29 42.22,17.2
  Top 0.203: 42.22,17.2 U1.27 | L1.2 43.89,18.95 43.11,18.95 D.1
DBG_RX  (via drill 0.35)
  Top 0.203: v33.22,7.34 32.97,7.09 32.97,3.68 33.66,3 X1.7 | v43.65,6.92 | v43.65,6.92 43.65,5.83 U1.9
  Bottom 0.203: v43.65,6.92 43.46,6.73 33.43,6.73 33.22,6.93 v33.22,7.34
DBG_TX  (via drill 0.35)
  Top 0.203: U1.10 | v44.48,6.94 U1.10 | v32,7.34 32.26,7.09 32.26,2.92 32.38,2.79 X1.8
  Bottom 0.203: v44.48,6.94 44.48,6.83 43.95,6.3 32.63,6.3 32,6.93 v32,7.34
DIO0  (via drill 0.35)
  Top 0.203: U6.14 83.99,11.89 78.98,16.89 v77.77,16.89 | v68,17.14 66.74,17.14 U$1.P2 | v45.03,15.44 45.03,14.76 44.86,14.58 44.86,10.22 45.91,10.22 46.14,10.46 46.73,10.46 U1.16 46.79,10.51
  Bottom 0.152: v68,17.14 66.9,17.14 64.82,15.06 47.95,15.06 47.9,15.11 45.36,15.11 v45.03,15.44
  Bottom 0.203: v77.77,16.89 77.52,17.14 v68,17.14
DIO1  (via drill 0.35)
  Top 0.203: U6.15 83.65,13.89 82.3,15.24 v82.3,15.62 | v67.97,15.88 67.86,15.77 U$1.P3 | v44.25,15.16 44.48,14.93 44.48,9.84 46.9,9.84 U1.15
  Bottom 0.152: v67.97,15.88 67.79,16.05 66.24,16.05 64.92,14.73 47.83,14.73 47.75,14.81 44.6,14.81 v44.25,15.16
  Bottom 0.203: v82.3,15.62 79.08,15.62 78.82,15.88 v67.97,15.88
DIO2  (via drill 0.35)
  Top 0.203: U6.16 84.47,15.89 v83.82,15.24 | v67.97,14.61 67.96,14.6 66.74,14.6 U$1.P4 | v43.51,14.81 43.66,14.81 44.09,14.38 44.09,9.45 45.85,9.45 46.09,9.21 46.73,9.21 U1.14
  Bottom 0.152: v67.97,14.61 67.72,14.86 65.48,14.86 65.02,14.4 47.73,14.4 47.62,14.5 43.81,14.5 v43.51,14.81
  Bottom 0.203: v83.82,15.24 83.82,15.14 83.19,14.5 78.84,14.5 78.51,14.83 68.2,14.83 v67.97,14.61
DIO5  (via drill 0.35)
  Top 0.203: U6.7 71.16,3.97 70.04,3.97 69.41,4.6 69.41,6.08 68.73,6.76 68.73,12.8 | 68.73,12.8 | U$1.P7 68.3,10.7 68.73,11.12 68.73,12.8 | 68.73,12.8 68.73,17.88 68.28,18.33 68.28,18.38 v68.31,18.41 | U1.26 43.03,17.21 v43.03,18.26
  Bottom 0.152: v68.31,18.41 68.09,18.62 67.93,18.62 64.7,15.39 50.08,15.39 49.42,16.05 47.93,16.05 47.61,16.38 47.21,16.38 46.96,16.63 45.7,16.63 44.97,17.36 44.28,17.36 44,17.64 43.58,17.64 43.03,18.2 v43.03,18.26
DRF_RST  (via drill 0.35)
  Top 0.203: U6.6 71.16,5.97 70.05,5.97 69.11,6.91 69.11,18.4 v69.1,18.42 69.1,18.52 68.56,19.05 68.05,19.05 67.32,18.32 U$1.P1 | U1.25 43.7,17.08 43.7,17.81 43.84,17.96 v43.84,18.26
  Bottom 0.152: v69.1,18.42 69.1,18.54 68.63,19 67.85,19 64.57,15.72 50.26,15.72 49.62,16.36 48.11,16.36 47.78,16.68 47.39,16.68 47.13,16.93 45.83,16.93 45.09,17.67 44.41,17.67 43.84,18.24 v43.84,18.26 43.84,18.21
EXTINT0  (via drill 0.35)
  Top 0.203: 25.43,14.47 U$3.5_EXTINT0 25.17,14.73 v23.5,14.73 | v36.96,15.04 36.75,14.83 36.47,14.83 36.37,14.73 35.75,14.73 U1.35
  Bottom 0.203: v36.96,15.04 36.85,15.04 36.17,14.35 23.7,14.35 23.5,14.55 v23.5,14.73
FB
  Top 0.203: U2.10 59.86,17.15 59.33,17.68 58.24,17.68 | E.2 58.24,17.68 | 58.24,17.68 F.1
GND  (via drill 0.35, 0.45, 0.5)
  Top 0.152: D.2 C.2
  Top 0.203: U2.9 60.36,15.5 U2.15 | 53.34,18.41 J1.5 54.03,18.99 54.61,18.41 J1.3 55.76,18.41 55.88,18.41 | J1.9 51.95,18.41 52.07,18.41 | v46.79,3.7 46.76,3.67 46.76,1.37 46.71,1.32 44.6,1.32 Y1.2 44.6,4.09
  Top 0.254: U2.4 61.36,14.5 U2.15
  Top 0.305: C22.2 60.22,5.92 60.54,5.59 U9.1 59.39,5.01 C23.2
  Bottom 0.152: 47.57,12.42 45.11,12.42 45.1,12.41 BT1.P$4 | 45.31,10.15 BT1.P$4 | BT1.P$4 45.1,7.87 47.6,7.87 | 40.84,12.39 40.8,12.35 BT1.P$7 | BT1.P$7 40.8,11.42 41.69,12.32 44.22,12.32 | BT1.P$4 45.1,8.58 44.42,7.9 40.89,7.9 40.8,8 BT1.P$7 | BT1.P$7 40.8,11.22 39.65,12.37 38.08,12.37 | BT1.P$7 40.8,8.15 40.7,8.05 38.08,8.05
  Bottom 0.203: BT1.P$7 40.72,9.73
  Bottom 1.016: BT1.P$8 BT1.P$2 | BT1.P$7 BT1.P$4
  other vias: 92,7.9 92,13 30.48,5.2 26.67,6.93 24.63,7 22.55,7 49.28,3.67 49.28,2.05 46.82,2.05 13.34,0.64 13.34,1.91 13.34,3.17 13.34,4.45 13.34,5.71 13.34,6.99 13.34,8.26 13.34,9.53 13.34,10.79 13.34,12.06 13.34,13.34 13.34,14.8 14.6,16.3 14.5,14.6 14.5,13.6 14.53,12.55 13.18,17.32 13.18,18.59 14.63,18.59 13.92,18.09 13.18,19.53 14.83,19.53 14.5,15.5 14.61,4.45 15.24,3.81 16.51,5.08 17.14,1.91 17.14,0.64 20.32,0.64 20.32,3.17 20.32,4.45 20.32,5.64 18.08,3.17 23.19,0.64 24.49,0.64 23.34,3.43 27.94,3.17 29.21,3.17 28.57,6.86 17.45,19.38 17.45,18.11 17.45,16.84 17.45,15.57 17.45,14.3 17.45,13.03 17.45,11.76 17.45,9.78 23.8,19.38 23.8,18.11 23.8,16.84 23.8,15.57 22.53,19.38 21.26,19.38 20.62,19.38 21.89,19.38 23.16,19.38 23.8,18.75 23.8,17.48 23.8,16.21 17.45,18.75 17.45,17.48 17.45,16.21 17.45,14.94 17.45,13.67 17.45,12.4 17.45,11.13 17.45,10.49 23.8,12.4 23.8,10.49 23.8,9.86 18.08,14.3 18.72,14.3 19.35,14.3 19.99,14.3 20.62,14.3 21.26,14.3 21.89,14.3 22.53,14.3 18.08,11.76 18.72,11.76 19.35,11.76 19.99,11.76 20.62,11.76 21.26,11.76 21.89,11.76 22.53,11.76 23.16,11.76 23.8,11.76 23.16,10.49 22.53,10.49 21.92,10.49 21.31,10.49 20.7,9.91 20.7,9.27 17.14,7.87 22.53,12.4 22.53,13.03 22.53,13.67 22.53,14.94 22.53,15.57 23.16,15.57 23.16,17.48 22.53,17.48 21.89,17.48 21.26,17.48 20.62,17.48 26.75,19.53 28.12,19.53 30.28,19.53 31.55,19.53 32.82,19.53 35.43,19.53 39.5,19.53 46.69,19.53 48.41,19.53 57.48,19.53 65.1,19.53 61.95,19.53 66.37,19.53 68.96,19.53 67.34,19.53 70.15,19.38 71.42,19.38 72.69,19.38 73.96,19.48 75.23,19.48 76.5,19.38 77.77,19.38 79.04,19.38 80.31,19.38 81.58,19.02 82.85,19.25 84.12,19.35 85.39,19.35 86.64,19.35 87.88,19.33 88.52,19.28 83.49,19.3 84.76,19.35 86,19.35 87.27,19.35 82.22,19.25 81.28,18.44 81.38,17.83 81.38,17.22 84,17.27 84.71,17.27 85.37,17.27 86,17.27 86.66,17.27 87.33,17.27 89.08,18.85 89.59,18.34 90.04,17.88 90.45,17.35 90.55,16.69 90.55,16.03 90.55,13.21 90.55,12.62 90.55,12.04 90.5,11.46 91.11,11.73 91.74,11.73 92.38,11.73 93.01,11.73 93.65,11.73 94.28,11.73 90.5,9.37 90.55,13.82 87.93,17.04 88.39,16.59 88.47,15.98 88.47,15.37 88.47,13.82 88.47,13.16 88.47,12.5 88.47,11.84 88.47,11.15 88.47,10.39 88.47,9.75 88.47,9.12 88.47,8.51 88.47,7.87 88.47,7.24 88.47,6.63 88.47,6.02 88.47,5.44 88.47,4.88 88.47,4.29 88.09,2.95 84.2,2.29 84.2,1.65 84.3,1.02 84.94,0.76 85.57,0.76 86.21,0.76 86.84,0.76 87.48,0.76 88.21,0.86 88.93,0.94 89.46,1.37 89.97,1.88 90.42,2.39 90.17,0.66 90.53,4.22 90.53,4.85 90.53,5.54 90.55,8.76 90.55,8.15 90.55,7.52 90.55,6.91 91.11,9.14 91.74,9.14 92.38,9.14 93.01,9.14 93.65,9.14 94.28,9.14 94.16,19.15 94.26,14.27 92.35,14.27 89.85,19.36 94.26,6.65 92.35,6.65 91.74,0.64 94.16,0.78 84.23,2.92 84.2,4.29 83.19,0.48 81.92,0.48 80.64,0.48 78.74,5.74 78.74,7.65 80.01,7.65 80.01,5.74 81.28,5.74 81.28,7.65 74.93,1.93 84.12,7.65 84.12,13.03 83.24,16.03 81.28,12.09 80.01,12.09 78.74,12.09 77.47,12.09 76.2,12.09 74.93,12.73 73.66,14 75.56,14 76.83,14 78.11,13.97 79.38,13.67 80.64,13.67 81.92,13.03 73.66,16.51 76.83,16.51 75.23,16.51 70.18,17.83 71.45,17.83 72.72,17.83 76.53,17.83 77.8,17.83 79.07,17.83 80.34,17.83 80.34,16.56 81.53,16.51 73.48,12.12 73.33,8.41 74.42,11.23 74.12,7.59 74.63,9.12 76.43,9.09 73.66,1.93 79.81,3.2 79.38,4.47 78.11,4.47 80.64,4.47 81.92,4.47 83.19,4.47 68.58,1.93 66.32,0.58 64.59,0.58 63.14,5.21 64.08,5.18 59.87,2.24 58.72,2.21 57.45,2.24 56.49,2.24 55.52,2.24 58.09,7.67 59.36,7.32 63.2,7.59 54.86,7.95 55.3,5.54 52.7,5.08 51.46,5.51 49.43,8.18 48.13,10.24 49.53,10.06 48.13,12.37 51.18,8.46 51.18,10.21 51.21,11.99 53.01,8.08 53.59,2.24 49.53,12.24 52.78,11.33 52.96,12.37 54.69,12.37 56.52,11.43 59.39,11.76 42.14,3.67 37.47,8.89 37.47,7.62 45.67,7.04 37.47,10.16 37.47,11.43 37.47,12.7 38.63,13.31 37.59,15.62 41.27,15.32 42.55,14.83 43.48,15.77 36.2,17.2 33.02,15.93 30.73,15.93 32.38,15.04 31.83,12.93 33.12,12.95 29.39,11.81 28.09,11.96 27.81,13.34 27.81,15.04 26.92,16 27.86,17.27 28.07,16.41 31.42,8.28 33.5,8.28 32.49,8.28 25.11,9.07 22.5,8.89 35.26,0.51 20.68,10.49 57.35,16.36 59.18,16.33 61.98,9.45 61.54,12.42 62,11.43 64.85,18.16 63.91,16.97 63.91,16.38 59.16,16.97 59.51,18.29 59.19,13.8 78.44,3.17 78.44,1.42 79.6,1.68 90.55,15.37 57.23,13.56
  pour Top (rank 6): 13,20 13,0 95,0 95,20
  pour Bottom: 95,20 95,0 13,0 13,20
  pour Top (no thermals): 61.59,15.65 62.92,15.65 62.92,14.35 61.59,14.35
  pour Top (no thermals): 56.36,14.81 57.58,14.81 57.58,14.31 56.36,14.29
  pour Top (no thermals): 58.85,15.62 59.74,15.62 59.74,14.41 58.85,14.39
  pour Top (no thermals): 57.76,14.81 58.65,14.81 58.65,14.54 57.76,14.53
  pour Top (no thermals): 63.04,15.32 63.63,15.32 63.63,14.82 63.04,14.81
GPS_ON  (via drill 0.35)
  Top 0.203: v36.96,13.4 36.96,13.28 36.89,13.21 35.82,13.21 U1.37 | U3.3 v28.85,12.71 v28.85,12.7
  Bottom 0.203: v28.85,12.7 28.85,12.78 29.66,13.59 36.09,13.59 36.92,13.59 37.01,13.5 37.01,13.45 v36.96,13.4
L
  Top 0.254: U2.3 60.86,11.18 60.25,10.57
  Top 0.305: 60.25,10.57 L6.P$2
  pour Top (no thermals): 59.72,10.45 59.72,10.66 60.81,13.02 60.81,10.45
MISO  (via drill 0.35)
  Top 0.203: U1.2 38.02,5.74 38.02,3.35 37.47,2.79 X1.4 | U6.2 72.82,13.89 77.11,9.6 77.11,5.31 v76.94,5.13 | U$1.P11 65.62,5.62 64.9,4.89 v64.9,4.09
  Bottom 0.203: v76.94,5.13 76.78,4.98 75.54,4.98 74.7,4.14 69.11,4.14 68.7,4.55 68.15,4.55 67.75,4.15 64.83,4.15 v64.9,4.09 64.69,3.89 64.69,2.16 63.58,1.04 38.46,1.04 37.47,2.03 X1.4 37.47,2.84 37.05,3.25 30.2,3.25 28.18,5.27 27.34,4.43 J2.1
MOSI  (via drill 0.35)
  Top 0.203: X1.5 36.2,2.79 37.27,3.87 U1.1 | U6.3 72.79,11.89 75.82,8.86 v75.82,4.32 | v68.43,3.91 67.87,3.91 67.49,4.29 66.69,4.29 U$1.P12
  Bottom 0.203: v75.82,4.32 75.41,4.32 74.85,3.76 68.56,3.76 68.43,3.89 v68.43,3.91 68.28,3.76 65.52,3.76 65.12,3.36 65.12,2.04 63.74,0.66 37.9,0.66 36.45,2.11 X1.5 35.97,2.11 34.52,0.66 25.38,0.66 24.54,1.49 J2.4
N$1  (2 unrouted)
  Top 0.254: 83.59,18.32 83.59,18.31 U$1.P15
  Top 0.305: C17.2 89.76,12.32 R23.2
  Top 1.016: 89.51,12.12 89.51,16.94 88.15,18.3 83.74,18.3
N$2
  Top 0.203: D1.A 32.46,11.52 32.46,13.36 33.12,14.02 33.53,14.02 R4.1
N$3
  Top 0.203: 45.57,4.47 45.8,4.24 Y1.3 45.8,4.1 | 45.57,4.47 43.56,4.47 43.05,4.98 43.05,5.62 U1.8 | C15.1 50.98,1.07 51.33,1.41 51.33,4.06 51.09,4.3 Y3.3 48.71,6.02 TP1.TP 47.45,5.87 46.05,4.47 45.57,4.47
N$4
  Top 0.203: U1.7 42.02,5.75 42.02,4.96 43.4,3.58 Y1.1 43.4,1.43 43.89,0.94 47.42,0.94 C16.1 47.55,2.03 Y3.1
N$5
  Top 0.152: R2.1 32.59,16.68 33.37,16.68 33.71,17.02 33.71,17.14 33.97,17.4 35.2,17.4 35.23,17.43 35.23,17.81 36.65,17.81 37.34,17.12
  Top 0.203: 37.34,17.12 U1.33 37.18,16.97 | R2.1 R3.2
N$7
  Top 0.203: N.2 M.1 34.75,18.11 34.78,18.14 37.73,18.14 37.95,17.92 37.95,17.18 U1.32
N$8
  Top 0.203: 35.47,15.26 U1.34 35.42,15.2 33.66,15.2 R4.2
N$10
  Top 0.152: 11.5,14.4 U$2.SIG
  Top 0.61: 15.05,17.75 U$3.11_RF_IN 14.85,17.75 13.78,16.68 R17.2 13.56,16.46 11.5,14.4
N$11  (via drill 0.35)
  Top 0.203: D2.C 18.77,4.08 v18.75,4.08 | U$3.6_V_BCKP 25.54,15.46 26.56,15.46 27,15.02 27,12.77 v27.3,12.46
  Top 0.305: v15.24,5.04 C9.+
  Bottom 0.203: v18.75,4.08 16.2,4.08 v15.24,5.04 C9.+ 16.8,8.5 19.05,8.5 C11.1 19.1,11.13 24.37,11.13 25.69,12.46 v27.3,12.46
N$12
  Top 0.203: U$3.3_RXD1 25.73,11.97 26.41,11.97 28.12,10.26 28.44,10.26 L3.1
N$13
  Top 0.203: U$3.2_TXD1 25.7,11.4 26.44,11.4 28.07,9.78 28.49,9.78 L2.1
N$14
  Top 0.203: U$3.17_SCL2 15.67,11.43 14.86,11.43 14.34,10.91 14.34,9.42 14.64,9.11 17.71,9.11 18.19,8.63 21.34,8.63 21.87,8.1 L4.1
N$15
  Top 0.203: 15.82,12.12 U$3.16_SDA2 15.68,11.98 14.87,11.98 13.96,11.07 13.96,9.23 14.44,8.76 17.54,8.76 17.95,8.34 L5.1
N$16
  Top 0.203: R5.2 17.55,6.58 17.39,6.43 17.39,2.83 D2.A
N$20
  Top 0.152: U1.31 38.7,17.23 38.7,17.84 38.02,18.52 38.02,18.92 B.1
  Top 0.203: B.1 A.2
N$23
  Top 0.203: 86.33,1.89 U6.9
  Top 0.305: 89.5,8.68 89.5,6.56 C20.1 89.5,6.56 R24.2
  Top 1.016: U6.9 88.53,1.9 89.5,2.86 89.5,8.68
N$24  (via drill 0.5)  (3 unrouted)
  Top 0.152: J$1.SIG 92.97,10.41 92.08,10.41
  Top 1.016: 92.08,10.41 89.65,10.41
  other vias: 92,10.4
NSS  (via drill 0.35)
  Top 0.203: U6.5 72.85,7.89 73.66,7.08 v73.66,5.99 v73.66,3.1 | U$1.P13 65.9,2.34 v65.79,2.34 | v48.92,7.39 48.92,7.47 48.36,8.03 47.11,8.03 U1.13
  Bottom 0.203: v73.66,3.1 73.38,3.38 68.79,3.38 68.68,3.27 68.17,3.27 68.06,3.38 65.69,3.38 65.5,3.19 65.5,2.62 v65.79,2.34 | v73.66,5.99 73.41,6.25 65.44,6.25 65.17,5.99 64.54,5.99 64.35,6.17 58.63,6.17 58.5,6.04 57.99,6.04 57.7,6.33 51.76,6.33 51.09,6.99 49.78,6.99 49.49,6.71 48.92,6.71 v48.92,7.39
PPS  (via drill 0.35)
  Top 0.203: U$3.4_TIMEPULSE 25.43,13.34 v23.5,13.34 | v36.96,14.23 36.73,14 35.82,14 U1.36
  Bottom 0.203: v23.5,13.34 23.5,13.51 23.95,13.97 36.57,13.97 36.83,14.23 v36.96,14.23
PS
  Top 0.203: U2.8 60.84,16.5 60.84,18.15 H.2 61.35,18.19 G.1
RST  (via drill 0.35)
  Top 0.203: X1.2 40.01,2.72 39.57,3.15 39.57,5.7 U1.4 39.88,6 v39.88,15.4 v39.88,15.41 | J1.10 50.84,17.72 50.45,18.11 R1.2
  Bottom 0.152: J1.10 50.86,17.72 50.08,18.5 46.03,18.5 45.97,18.43 45.43,18.43 44.96,18.9
  Bottom 0.203: v39.88,15.41 41.3,16.83 41.3,18.22 41.98,18.9 44.96,18.9 | J2.5 22,4.52 23.74,6.26 28.26,6.26 30.54,3.98 37.4,3.98 38.58,2.79 39.01,2.79 39.7,2.11 X1.2
RX1  (via drill 0.35)
  Top 0.203: v46.02,5.79 v46.02,5.8 U1.11 | L2.2 29.79,9.4 v29.79,8.05
  Bottom 0.203: v29.79,8.05 29.74,8 30.4,7.34 30.55,7.34 32.35,5.54 45.8,5.54 46.02,5.77 v46.02,5.79
SCK  (via drill 0.35)
  Top 0.203: U1.3 38.8,5.72 38.8,2.17 X1.3 | U6.4 72.86,9.9 74.8,7.95 74.8,5.26 v74.68,5.13 | v68.45,5.26 68.45,5.74 67.13,7.06 66.82,7.06 U$1.P10
  Bottom 0.203: v68.45,5.26 68.45,4.93 | 68.45,4.93 67.97,4.93 67.59,4.55 65.43,4.55 65.24,4.73 64.64,4.73 64.25,4.34 64.25,2.27 63.37,1.4 39.04,1.4 38.61,1.83 38.61,1.98 X1.3 37.24,3.61 30.39,3.61 28.11,5.88 25.6,5.88 24.54,4.83 J2.3 | v68.45,5.26 | 68.45,4.93 68.85,4.93 69.26,4.52 74.55,4.52 74.68,4.64 v74.68,5.13
SCL  (via drill 0.35)
  Top 0.203: L4.2 R11.1 23.62,8.1 v23.62,8.59 | U1.19 47.1,13.23 49.51,13.23 50.16,12.58 50.16,8.06 50.24,7.98 50.24,6.55 v50.04,6.35
  Bottom 0.203: v50.04,6.35 50.01,6.33 47.44,6.33 46.27,5.16 32.21,5.16 30.38,6.99 30.21,6.99 29.76,7.43 29.51,7.43 28.87,8.08 24.13,8.08 v23.62,8.59
SDA  (via drill 0.35)
  Top 0.203: L5.2 R12.1 19.98,7.98 20.42,7.54 20.95,7.54 21.18,7.32 v21.18,6.99 | U1.20 47.11,13.63 49.64,13.63 50.54,12.73 50.54,8.22 50.63,8.13 50.63,6.58 v50.86,6.35
  Bottom 0.203: v21.18,6.99 21.89,7.7 28.72,7.7 29.36,7.05 29.61,7.05 30.06,6.6 30.23,6.6 32.04,4.79 46.46,4.79 47.64,5.97 49.55,5.97 49.78,5.73 50.29,5.73 50.89,6.33 50.88,6.33 v50.86,6.35
TCK  (via drill 0.35)
  Top 0.203: U1.21 47.11,14.83 47.94,14.83 48.13,15.03 48.13,16.73 48.49,17.09 v48.49,17.27
  Bottom 0.152: v48.49,17.27 48.7,17.48 49.51,17.48 50.63,16.36 52.29,16.36 52.45,16.51 53.19,16.51 53.36,16.68 53.62,16.94 54.21,16.94 54.99,17.72 J1.4
TDI  (via drill 0.35)
  Top 0.203: U1.24 44.47,17.75 44.65,17.93 v44.65,18.26
  Bottom 0.152: J1.8 51.89,16.97 51.03,16.97 49.81,18.19 46.15,18.19 46.09,18.13 44.79,18.13 v44.65,18.26
TDO  (via drill 0.35)
  Top 0.203: v46.08,17.53 45.24,17.53 45.24,17.1 U1.23
  Bottom 0.152: v46.08,17.53 46.08,17.6 46.35,17.88 49.61,17.88 50.83,16.66 52.12,16.66 52.37,16.89 53.11,16.89 J1.6
TMS  (via drill 0.35)
  Top 0.203: U1.22 47.03,15.56 47.75,15.56 47.75,17.18 v47.65,17.28
  Bottom 0.152: v47.65,17.28 47.65,17.27 48.24,16.68 49.8,16.68 50.39,16.1 | 50.44,16.04 50.39,16.1 | 50.39,16.1 50.44,16.04 | 50.44,16.04 52.51,16.04 52.66,16.18 53.32,16.18 53.75,16.61 54.37,16.61 54.7,16.94 55.53,16.94 56.31,17.72 J1.2
TX1  (via drill 0.35)
  Top 0.203: v48.11,7.39 46.94,7.39 U1.12 | L3.2 29.67,10.44 30.2,9.91 30.2,8.52 30.61,8.11 v30.61,8.05
  Bottom 0.203: v30.61,8.05 30.61,7.82 32.49,5.94 45.3,5.94 45.78,6.43 46.94,6.43 47.22,6.71 48.11,6.71 v48.11,7.39
UVLO
  Top 0.203: U2.7 61.36,16.97 62.58,18.18 62.58,18.13 I.2 62.61,18.18 J.1
VAUX
  Top 0.254: U2.1 59.86,13.14 58.7,13.14 K.2
VBATT  (via drill 0.35)
  Top 0.203: v54.66,11.27 53.62,12.32 v53.62,13.17 | v33.12,17.3 32.42,17.89 R2.2
  Top 0.305: C19.1 54.23,10.61 | 54.23,10.61 54.51,10.61 54.66,10.77 | B2.1 54.66,10.61 54.66,10.77 | U5.3 54.03,7.13 54.15,7.25 54.15,9.14 | 54.23,10.61 54.23,9.22 54.15,9.14 | U5.1 54.04,9.03 54.15,9.14 | 54.66,10.77 v54.66,11.27
  Bottom 0.152: v33.12,17.3 33.83,16.59 38.07,16.59 38.56,16.1 38.56,14.78 39.29,14.05 40.56,14.05 40.9,14.38 41.65,14.38 42.15,13.89 47.34,13.89 47.44,13.79 53,13.79 v53.62,13.17 | 69.85,12.55 65.41,12.55 | 70.2,7.77 65.41,7.77 | 82.53,11.22 80.01,11.22 | 82.56,9.12 80.03,9.12
  Bottom 0.305: 66.54,10.41 66.7,10.25 | BT1.P$6 69.85,10.5 69.85,12.55 | 65.41,12.55 65.41,10.41 | BT1.P$6 70.2,7.91 70.48,7.62 | BT1.P$6 70.2,7.77 | 82.53,11.22 BT1.P$5 82.56,9.12
  Bottom 0.508: 66.54,10.41 65.41,10.41 | J4.2 92.28,16 90.88,14.6 87.72,14.6 86.36,13.23 86.36,10.15 BT1.P$5 83.6,10.47
  Bottom 0.813: v54.66,11.27 55.52,10.41 65.41,10.41
  Bottom 1.016: BT1.P$3 66.7,10.25 69.85,10.25 | 69.85,10.25 70.69,10.25 BT1.P$6 | BT1.P$5 BT1.P$1 69.95,10.15 69.85,10.25
VCC  (via drill 0.35)
  Top 0.203: 35.6,12.27 U1.38 | 34.91,2.09 X1.6 | C1.2 40.43,3.79
  Top 0.254: U1.5 40.48,3.98 C1.2 | C3.2 33.66,12.17 | X1.6 34.92,3.38 34.18,4.12 34.18,12.18 | R11.2 25.1,7.46 25.81,6.74 25.81,6.33 | J2.2 27.08,2.23 25.81,3.5 25.81,6.33 | 21.87,6.33 25.81,6.33 | R12.2 21.04,8.1 21.87,7.27 21.87,6.33 | 21.87,6.33 21.87,6.32 20.31,6.32 19.64,6.99 R5.1 | B5.2 30.2,15.35 30.2,13.63 30.49,13.34 30.92,13.34 U3.4 30.94,12.5 30.85,12.41 v30.24,12.41 | 34.91,2.09 34.91,1.78 35.69,0.99 41.61,0.99 41.99,1.37 41.99,2.67 41.28,3.38 40.84,3.38 40.43,3.79
  Top 0.305: 47.03,11.56 U1.17 47,11.53 47.69,11.53 47.81,11.65 48.82,11.65 C2.2 v48.9,11.02 48.84,10.96 48.84,9.09 v48.82,9.07 | U6.13 84.33,9.89 83.19,8.74 v83.19,6.68 | v64.87,6.6 65.07,6.81 65.07,8.94 65.53,9.4 66.61,9.4 U$1.P8 | R1.1 49.53,19.02 | 49.53,19.02 49.53,17.8 49.81,17.53 50.4,17.53 51.14,16.79 51.64,16.79 | 51.64,16.79 56.73,16.79 57.31,17.36 57.31,18.18 56.5,18.99 J1.1 | B4.1 60.54,2.01 U9.2 59.39,3.11 C23.1 58.83,3.6 58.24,4.19 v58.24,6.68 | v45.72,19.02 44.94,19.02 L1.1 | v49.43,19.09 49.5,19.02 49.53,19.02 | U1.5 40.48,6 40.34,6.14 40.34,12.45 v41.27,13.39 | C3.2 33.66,12.28 34.29,12.28 | 34.29,12.28 v34.42,12.28 35.59,12.28 U1.38 | 34.18,12.18 34.29,12.28 | 51.64,16.79 v51.64,12.83
  Bottom 0.254: v34.42,12.28 30.24,12.28 30.18,12.34 v30.24,12.41 | v45.72,19.02 45.72,18.87 49.43,18.87 v49.43,19.09
  Bottom 0.305: v83.19,6.68 83.16,6.71 64.97,6.71 v64.87,6.6 58.32,6.6 v58.24,6.68 58.19,6.73 51.96,6.73 49.8,8.89 49,8.89 v48.82,9.07 | X1.6 34.92,1.73 34.29,1.09 27.89,1.09 J2.2 | v41.27,13.39 41.3,13.39 41.53,13.16 47.02,13.16 47.12,13.06 48.86,13.06 | v51.64,12.83 51.41,13.06 48.86,13.06 | 48.86,13.06 48.86,11.06 v48.9,11.02
VCC_GPS
  Top 0.203: 28.62,18.8 C8.2 | U$3.8_VCC 25.61,17.91 C7.2 | U$3.7_VCC_IO 25.7,16.9 26.68,16.9 27.13,17.35 27.13,18.8 | C6.2 28.73,16.9 | U$3.9_V_RESET 27.13,18.8 | 27.13,18.8 28.62,18.8 C8.2 | U3.1 28.68,14.8 28.68,15.8 B5.1 C6.2 | C6.2 C7.2 | C7.2 C8.2
VLITHIUM  (via drill 0.35)
  Top 0.152: B.2 38.94,18.93
  Top 0.203: F.2 57.65,15.64 55.45,15.64 54.86,15.06 v54.86,13.79 55.86,12.79 C13.2 | v39.02,18.39 38.82,18.59 B.2
  Top 0.254: U2.2 60.37,13.04 60.15,12.57 59.14,12.58 58.58,12.58 57.5,12.58 B3.1 56.41,12.63 C13.2
  Top 0.305: 58.58,12.58 58.58,8.3 59.95,8.3 61.14,7.11 C22.1 62.34,5.51 U9.3 62.34,1.78 62.13,1.57 B4.2 62.52,1.57 62.82,1.27 v67,1.27
  Bottom 0.152: v54.86,13.79 54.86,14.1 47.56,14.1 47.46,14.2 42.27,14.2 41.78,14.69 40.78,14.69 40.44,14.35 39.42,14.35 38.86,14.91 38.86,18.23 v39.02,18.39
  Bottom 0.305: J6.2 91.77,2 J5.2 90.16,3.62 83,3.62 C14.+ 81.19,2.23 79.66,0.7 67.57,0.7 v67,1.27
  pour Top (no thermals): 60.29,12.78 60.15,12.48 56.29,12.48 56.28,12.78
VSOLAR  (via drill 0.35)
  Top 0.203: v51.74,11 51.81,10.93 51.81,6.08 52.17,5.71 54.61,5.71 54.61,4.82 C18.1 | M.2 33.76,17.97 33.31,17.97 v33.1,18.19
  Top 0.254: U4.1 53.69,3.07 v54.71,3.07
  Top 0.305: C18.1 54.51,4.65 | 54.51,4.65 B1.2 | U4.3 53.61,1.32 54.37,1.32 54.51,1.46 54.51,3.38 | 54.51,3.38 54.51,4.65 | U4.1 54.31,3.19 54.51,3.38
  Bottom 0.152: C21.+ 31.11,17.7 31.82,17.7
  Bottom 0.203: 31.82,17.7 32.97,16.55 33.38,16.55 33.68,16.26 37.92,16.26 38.23,15.95 38.23,14.63 39.14,13.72 40.72,13.72 41,14 41.55,14 41.99,13.56 47.2,13.56 47.3,13.46 51.99,13.46 52.28,13.17 52.28,12.58 51.84,12.14 51.84,11.1 v51.74,11 | v33.1,18.19 32.61,17.7 31.11,17.7
  Bottom 0.305: v54.71,3.07 54.58,2.94 51.14,2.94 +S.1
VSS  (via drill 0.35)
  Top 0.203: G.2 59.63,19.11 v59.61,19.1 | 61.86,16.68 U2.6 61.86,16.94 62.52,17.6 64.02,17.6 64.19,17.77 64.19,17.78 | C10.2 64.07,13.32 64.85,13.32 64.85,17.12 64.19,17.78 | v64.34,19.06 64.19,18.91 64.19,17.78
  Top 0.305: B3.2 v57.46,8.84 v57.45,8.84 | U4.5 56.3,4.61 B1.1 v56.35,5.32 56.47,5.44 56.9,5.44 56.9,7.64 56.34,8.2 v55.73,8.2 U5.5 55.72,9.48 56.06,9.83 56.06,10.59 B2.2 | X1.9 31.24,2.23 v31.24,4.67 | J.2 63.68,19.06 v64.34,19.06
  Top 0.508: L6.P$1 63.2,10.01 v63.2,8.61
  Bottom 0.203: v64.34,19.06 64.16,18.88 59.84,18.87 v59.61,19.1 | 31.27,4.65 31.3,4.65
  Bottom 0.305: v55.73,8.2 56.29,8.76 57.38,8.76 v57.45,8.84 57.58,8.71 63.09,8.71 v63.2,8.61 | v31.24,4.67 31.27,4.65 | v56.35,5.32 55.41,4.38 31.56,4.38 31.3,4.65
  pour Top (rank 2, no thermals): 61.8,13.69 63.76,13.69 63.76,10.34 62.72,10.34 62.72,12.17 61.8,13.03

### Text on the board
tNames: DRF1278F | R I O K S | B | + | + | L | Super Tracker / G7 PMO / V 04 | RFM95/96/97/98W | + | +
bNames: Please Call / Kevin Walton / +44 7867 825 847 / Harmless Scientific / Experiment | + | S | VBATT | + | + | + | + | + | VLITH | L | + | + | + | JLCJLCJLCJLC